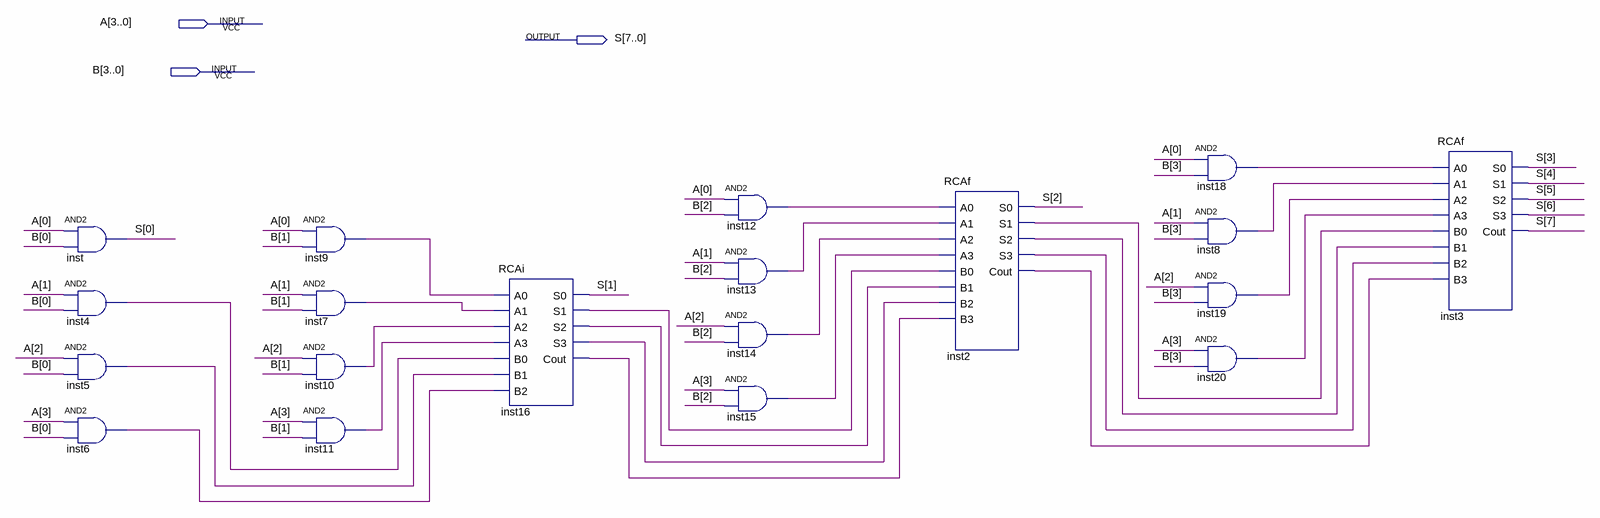
[diagram p0: schematic sheet]
// Quartus schematic MULT.bdf as structural Verilog: 19 symbols, 3 pins
module MULT (
  input  [3:0] A,
  input  [3:0] B,
  output [7:0] S
);

  wire inst2_cout, inst2_s1, inst2_s2, inst2_s3, inst4_out, inst5_out, inst6_out, inst7_out, inst8_out,
       inst9_out, inst10_out, inst11_out, inst12_out, inst13_out, inst14_out, inst15_out, inst16_cout,
       inst16_s1, inst16_s2, inst16_s3, inst18_out, inst19_out, inst20_out;

  and inst (S[0], A[0], B[0]);
  and inst4 (inst4_out, A[1], B[0]);
  and inst5 (inst5_out, A[2], B[0]);
  and inst6 (inst6_out, A[3], B[0]);
  and inst9 (inst9_out, A[0], B[1]);
  and inst7 (inst7_out, A[1], B[1]);
  and inst10 (inst10_out, A[2], B[1]);
  and inst11 (inst11_out, A[3], B[1]);
  RCAi inst16 (
    .A0(inst9_out), .A1(inst7_out), .A2(inst10_out), .A3(inst11_out), .B0(inst4_out), .B1(inst5_out),
    .B2(inst6_out), .S0(S[1]), .S1(inst16_s1), .S2(inst16_s2), .S3(inst16_s3), .Cout(inst16_cout));
  and inst12 (inst12_out, A[0], B[2]);
  and inst13 (inst13_out, A[1], B[2]);
  and inst14 (inst14_out, A[2], B[2]);
  and inst15 (inst15_out, A[3], B[2]);
  RCAf inst2 (
    .A0(inst12_out), .A1(inst13_out), .A2(inst14_out), .A3(inst15_out), .B0(inst16_s1), .B1(inst16_s2),
    .B2(inst16_s3), .B3(inst16_cout), .S0(S[2]), .S1(inst2_s1), .S2(inst2_s2), .S3(inst2_s3),
    .Cout(inst2_cout));
  and inst18 (inst18_out, A[0], B[3]);
  and inst8 (inst8_out, A[1], B[3]);
  and inst19 (inst19_out, A[2], B[3]);
  and inst20 (inst20_out, A[3], B[3]);
  RCAf inst3 (
    .A0(inst18_out), .A1(inst8_out), .A2(inst19_out), .A3(inst20_out), .B0(inst2_s1), .B1(inst2_s2),
    .B2(inst2_s3), .B3(inst2_cout), .S0(S[3]), .S1(S[4]), .S2(S[5]), .S3(S[6]), .Cout(S[7]));
endmodule
